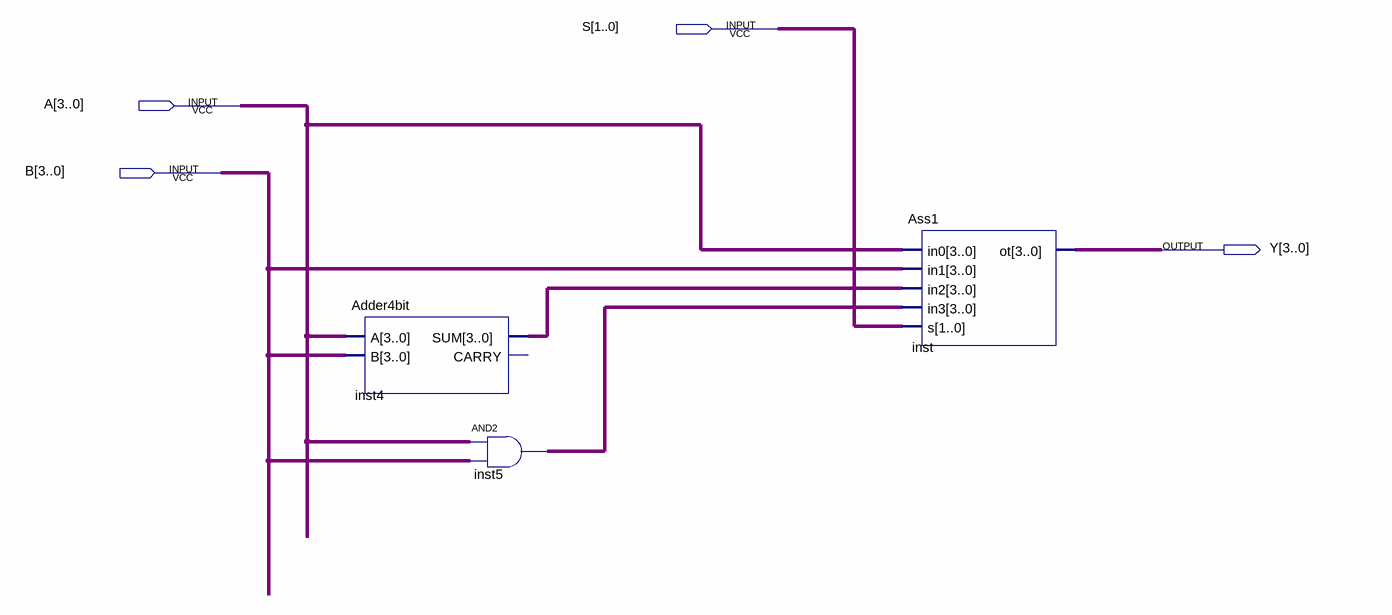
[diagram p0: schematic sheet]
// Quartus schematic ALU.bdf as structural Verilog: 3 symbols, 4 pins
module ALU (
  input  [1:0] S,
  input  [3:0] A,
  input  [3:0] B,
  output [3:0] Y
);

  wire [3:0] inst4_sum, inst5_out;

  Adder4bit inst4 (.A(A), .B(B), .SUM(inst4_sum));  // open: CARRY
  assign inst5_out = A & B;  // AND2 inst5, 4 bits wide
  Ass1 inst (.in0(A), .in1(B), .in2(inst4_sum), .in3(inst5_out), .s(S), .ot(Y));
endmodule
